# EAGLE schematic AeroQuad32 (EAGLE 5.11)
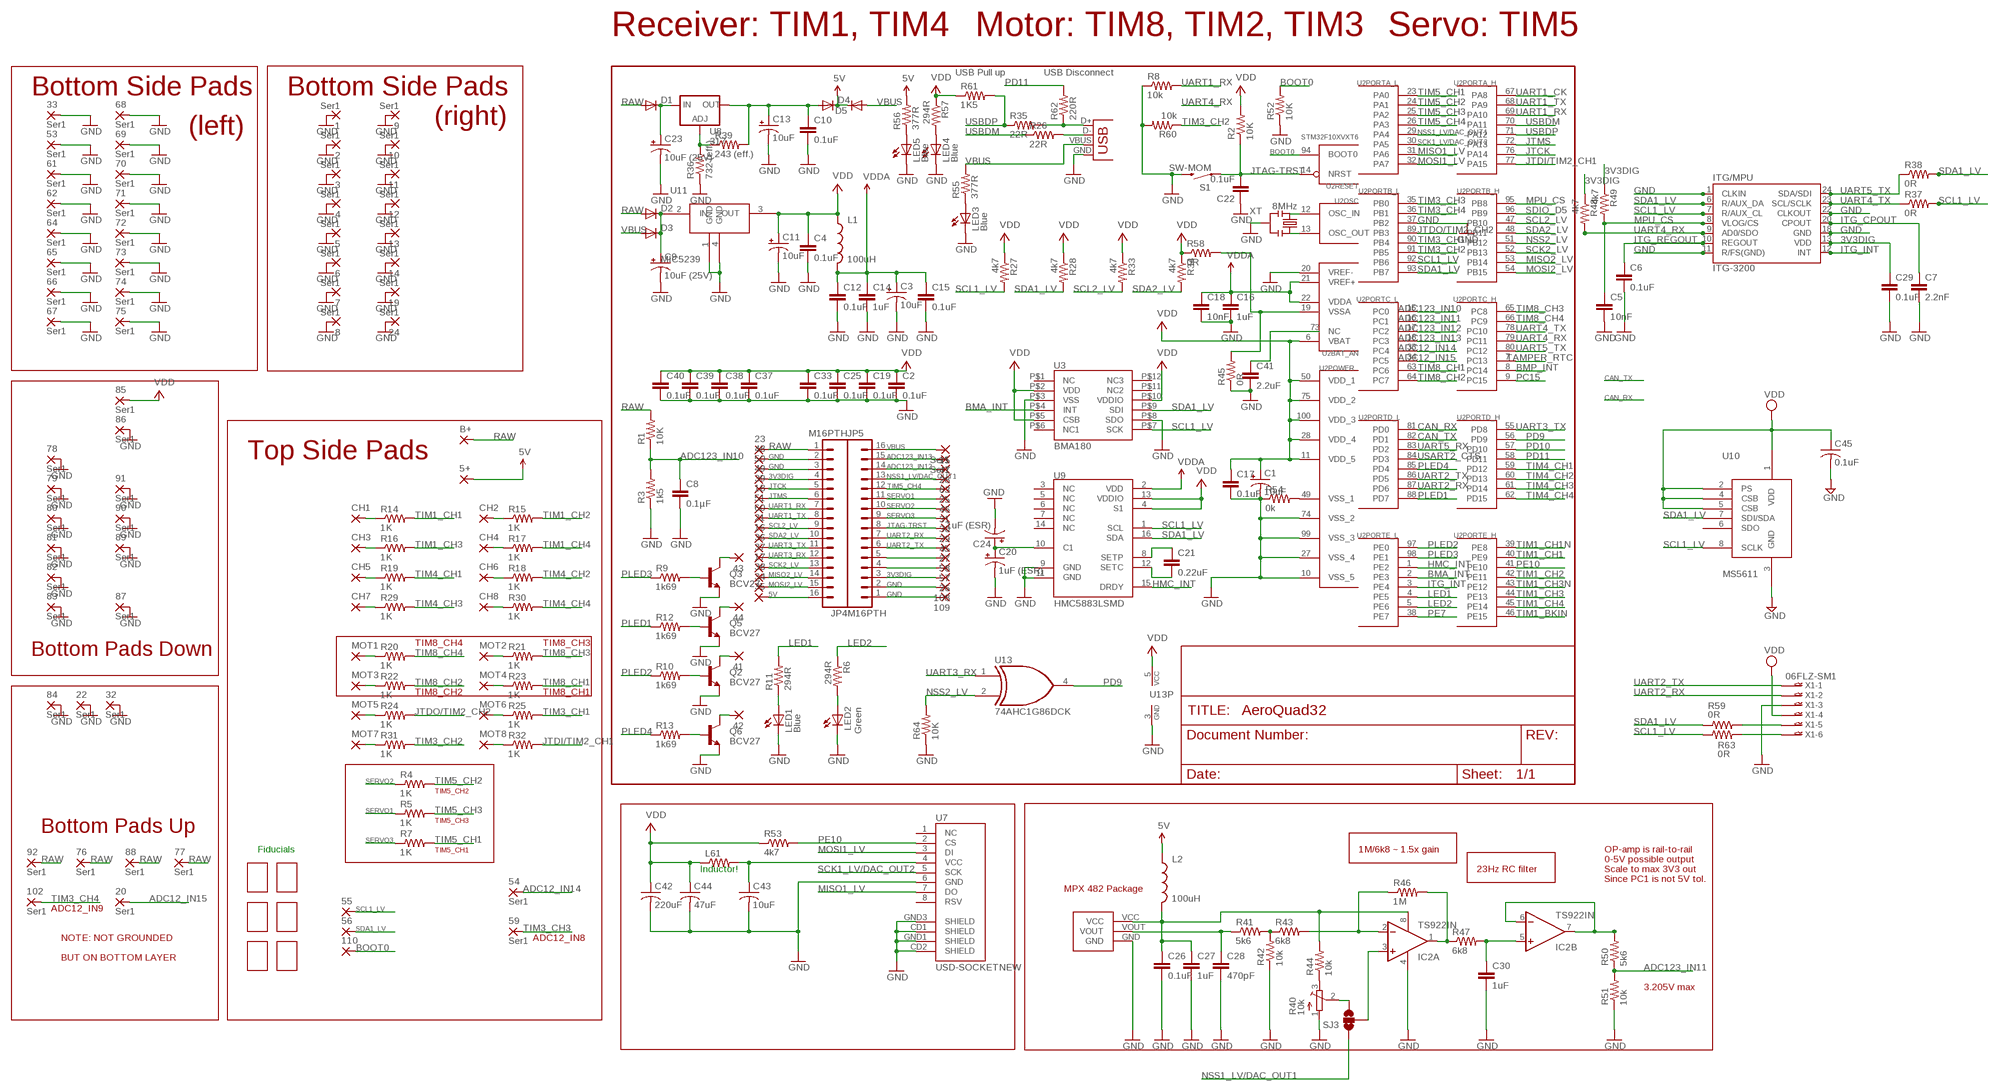
[diagram p0: schematic, sheet 1]

## Parts
1  Ser1  WIREPADSMD1,27-254  [SMD1,27-2,54]
2  Ser1  WIREPADSMD1,27-254  [SMD1,27-2,54]
3  Ser1  WIREPADSMD1,27-254  [SMD1,27-2,54]
4  Ser1  WIREPADSMD1,27-254  [SMD1,27-2,54]
5  Ser1  WIREPADSMD1,27-254  [SMD1,27-2,54]
5+  WIREPADSMD1,27-254  [SMD1,27-2,54]
6  Ser1  WIREPADSMD1,27-254  [SMD1,27-2,54]
7  Ser1  WIREPADSMD1,27-254  [SMD1,27-2,54]
8  Ser1  WIREPADSMD1,27-254  [SMD1,27-2,54]
9  Ser1  WIREPADSMD1,27-254  [SMD1,27-2,54]
10  Ser1  WIREPADSMD1,27-254  [SMD1,27-2,54]
11  Ser1  WIREPADSMD1,27-254  [SMD1,27-2,54]
12  Ser1  WIREPADSMD1,27-254  [SMD1,27-2,54]
13  Ser1  WIREPADSMD1,27-254  [SMD1,27-2,54]
14  Ser1  WIREPADSMD1,27-254  [SMD1,27-2,54]
15  WIREPADSMD1,27-254  [SMD1,27-2,54]
16  WIREPADSMD1,27-254  [SMD1,27-2,54]
17  WIREPADSMD1,27-254  [SMD1,27-2,54]
18  WIREPADSMD1,27-254  [SMD1,27-2,54]
19  Ser1  WIREPADSMD1,27-254  [SMD1,27-2,54]
20  Ser1  WIREPADSMD1,27-254  [SMD1,27-2,54]
21  WIREPADSMD1,27-254  [SMD1,27-2,54]
22  Ser1  WIREPADSMD1,27-254  [SMD1,27-2,54]
23  WIREPADSMD1,27-254  [SMD1,27-2,54]
24  Ser1  WIREPADSMD1,27-254  [SMD1,27-2,54]
25  WIREPADSMD1,27-254  [SMD1,27-2,54]
26  WIREPADSMD1,27-254  [SMD1,27-2,54]
27  WIREPADSMD1,27-254  [SMD1,27-2,54]
28  Ser1  WIREPADSMD1,27-254  [SMD1,27-2,54]
29  WIREPADSMD1,27-254  [SMD1,27-2,54]
30  WIREPADSMD1,27-254  [SMD1,27-2,54]
31  WIREPADSMD1,27-254  [SMD1,27-2,54]
32  Ser1  WIREPADSMD1,27-254  [SMD1,27-2,54]
33  Ser1  WIREPADSMD1,27-254  [SMD1,27-2,54]
34  WIREPADSMD1,27-254  [SMD1,27-2,54]
35  WIREPADSMD1,27-254  [SMD1,27-2,54]
36  WIREPADSMD1,27-254  [SMD1,27-2,54]
37  WIREPADSMD1,27-254  [SMD1,27-2,54]
38  WIREPADSMD1,27-254  [SMD1,27-2,54]
39  WIREPADSMD1,27-254  [SMD1,27-2,54]
41  WIREPADSMD1,27-254  [SMD1,27-2,54]
42  WIREPADSMD1,27-254  [SMD1,27-2,54]
43  WIREPADSMD1,27-254  [SMD1,27-2,54]
44  WIREPADSMD1,27-254  [SMD1,27-2,54]
45  WIREPADSMD1,27-254  [SMD1,27-2,54]
46  WIREPADSMD1,27-254  [SMD1,27-2,54]
47  WIREPADSMD1,27-254  [SMD1,27-2,54]
48  WIREPADSMD1,27-254  [SMD1,27-2,54]
49  WIREPADSMD1,27-254  [SMD1,27-2,54]
50  WIREPADSMD1,27-254  [SMD1,27-2,54]
51  WIREPADSMD1,27-254  [SMD1,27-2,54]
53  Ser1  WIREPADSMD1,27-254  [SMD1,27-2,54]
54  Ser1  WIREPADSMD1,27-254  [SMD1,27-2,54]
55  WIREPADSMD1,27-254  [SMD1,27-2,54]
56  WIREPADSMD1,27-254  [SMD1,27-2,54]
57  WIREPADSMD1,27-254  [SMD1,27-2,54]
58  WIREPADSMD1,27-254  [SMD1,27-2,54]
59  Ser1  WIREPADSMD1,27-254  [SMD1,27-2,54]
60  WIREPADSMD1,27-254  [SMD1,27-2,54]
61  Ser1  WIREPADSMD1,27-254  [SMD1,27-2,54]
62  Ser1  WIREPADSMD1,27-254  [SMD1,27-2,54]
63  Ser1  WIREPADSMD1,27-254  [SMD1,27-2,54]
64  Ser1  WIREPADSMD1,27-254  [SMD1,27-2,54]
65  Ser1  WIREPADSMD1,27-254  [SMD1,27-2,54]
66  Ser1  WIREPADSMD1,27-254  [SMD1,27-2,54]
67  Ser1  WIREPADSMD1,27-254  [SMD1,27-2,54]
68  Ser1  WIREPADSMD1,27-254  [SMD1,27-2,54]
69  Ser1  WIREPADSMD1,27-254  [SMD1,27-2,54]
70  Ser1  WIREPADSMD1,27-254  [SMD1,27-2,54]
71  Ser1  WIREPADSMD1,27-254  [SMD1,27-2,54]
72  Ser1  WIREPADSMD1,27-254  [SMD1,27-2,54]
73  Ser1  WIREPADSMD1,27-254  [SMD1,27-2,54]
74  Ser1  WIREPADSMD1,27-254  [SMD1,27-2,54]
75  Ser1  WIREPADSMD1,27-254  [SMD1,27-2,54]
76  Ser1  WIREPADSMD1,27-254  [SMD1,27-2,54]
77  Ser1  WIREPADSMD1,27-254  [SMD1,27-2,54]
78  Ser1  WIREPADSMD1,27-254  [SMD1,27-2,54]
79  Ser1  WIREPADSMD1,27-254  [SMD1,27-2,54]
80  Ser1  WIREPADSMD1,27-254  [SMD1,27-2,54]
81  Ser1  WIREPADSMD1,27-254  [SMD1,27-2,54]
82  Ser1  WIREPADSMD1,27-254  [SMD1,27-2,54]
83  Ser1  WIREPADSMD1,27-254  [SMD1,27-2,54]
84  Ser1  WIREPADSMD1,27-254  [SMD1,27-2,54]
85  Ser1  WIREPADSMD1,27-254  [SMD1,27-2,54]
86  Ser1  WIREPADSMD1,27-254  [SMD1,27-2,54]
87  Ser1  WIREPADSMD1,27-254  [SMD1,27-2,54]
88  Ser1  WIREPADSMD1,27-254  [SMD1,27-2,54]
89  Ser1  WIREPADSMD1,27-254  [SMD1,27-2,54]
90  Ser1  WIREPADSMD1,27-254  [SMD1,27-2,54]
91  Ser1  WIREPADSMD1,27-254  [SMD1,27-2,54]
92  Ser1  WIREPADSMD1,27-254  [SMD1,27-2,54]
102  Ser1  WIREPADSMD1,27-254  [SMD1,27-2,54]
108  WIREPADSMD1,27-254  [SMD1,27-2,54]
109  WIREPADSMD1,27-254  [SMD1,27-2,54]
110  WIREPADSMD1,27-254  [SMD1,27-2,54]
B+  WIREPADSMD1,27-254  [SMD1,27-2,54]
C1  10uF  CPOL-USSMCZ  [SMC_Z]
C2  0.1uF  CAP0402  [C0402]
C3  10uF  CAP_POL1206  [EIA3216]
C4  0.1uF  CAP0402  [C0402]
C5  10nF  CAP0402  [C0402]
C6  0.1uF  CAP0402  [C0402]
C7  2.2nF  CAP0402  [C0402]
C8  0.1µF  CAP0402  [C0402]
C9  10uF (25V)  CAP_POL1206  [EIA3216]
C10  0.1uF  CAP0402  [C0402]
C11  10uF  CAP_POL1206  [EIA3216]
C12  0.1uF  CAP0402  [C0402]
C13  10uF  CAP_POL1206  [EIA3216]
C14  1uF  CAP0402  [C0402]
C15  0.1uF  CAP0402  [C0402]
C16  1uF  CAP0402  [C0402]
C17  0.1uF  CAP0402  [C0402]
C18  10nF  CAP0402  [C0402]
C19  0.1uF  CAP0402  [C0402]
C20  1uF (ESR)  CPOL-USSMCZ  [SMC_Z]
C21  0.22uF  CAP0402  [C0402]
C22  0.1uF  CAP0402  [C0402]
C23  10uF (25V)  CAP_POL1206  [EIA3216]
C24  1uF (ESR)  CPOL-USSMCZ  [SMC_Z]
C25  0.1uF  CAP0402  [C0402]
C26  0.1uF  CAP0402  [C0402]
C27  1uF  CAP0402  [C0402]
C28  470pF  CAP0402  [C0402]
C29  0.1uF  CAP0402  [C0402]
C30  1uF  CAP0402  [C0402]
C33  0.1uF  CAP0402  [C0402]
C37  0.1uF  CAP0402  [C0402]
C38  0.1uF  CAP0402  [C0402]
C39  0.1uF  CAP0402  [C0402]
C40  0.1uF  CAP0402  [C0402]
C41  2.2uF  CAP0402  [C0402]
C42  220uF  C-USC0805  [C0805]
C43  10uF  C-USC0805  [C0805]
C44  47uF  C-USC1206  [C1206]
C45  0.1uF  C-USC0402  [C0402]
CH1  WIREPADSMD1,27-254  [SMD1,27-2,54]
CH2  WIREPADSMD1,27-254  [SMD1,27-2,54]
CH3  WIREPADSMD1,27-254  [SMD1,27-2,54]
CH4  WIREPADSMD1,27-254  [SMD1,27-2,54]
CH5  WIREPADSMD1,27-254  [SMD1,27-2,54]
CH6  WIREPADSMD1,27-254  [SMD1,27-2,54]
CH7  WIREPADSMD1,27-254  [SMD1,27-2,54]
CH8  WIREPADSMD1,27-254  [SMD1,27-2,54]
D1  DIODESOD  [SOD-323]
D2  DIODESOD  [SOD-323]
D3  DIODESOD  [SOD-323]
D4  DIODESOD  [SOD-323]
D5  DIODESOD  [SOD-323]
IC2  TS922IN  LM358D  [SO08]
JP4  M16PTH  [1X16]
JP5  M16PTH  [1X16]
L1  100uH  INDUCTOR0805  [0805]
L2  100uH  INDUCTOR0805  [0805]
L61  R-US_R0805  [R0805]
LED1  Blue  LED0603  [LED-0603]
LED2  Green  LED0603  [LED-0603]
LED3  Blue  LED0603  [LED-0603]
LED4  Blue  LED0603  [LED-0603]
LED5  Blue  LED0603  [LED-0603]
MOT1  WIREPADSMD1,27-254  [SMD1,27-2,54]
MOT2  WIREPADSMD1,27-254  [SMD1,27-2,54]
MOT3  WIREPADSMD1,27-254  [SMD1,27-2,54]
MOT4  WIREPADSMD1,27-254  [SMD1,27-2,54]
MOT5  WIREPADSMD1,27-254  [SMD1,27-2,54]
MOT6  WIREPADSMD1,27-254  [SMD1,27-2,54]
MOT7  WIREPADSMD1,27-254  [SMD1,27-2,54]
MOT8  WIREPADSMD1,27-254  [SMD1,27-2,54]
Q2  BCV27  TRANSISTOR_NPNSOT23-3  [SOT23-3]
Q3  BCV27  TRANSISTOR_NPNSOT23-3  [SOT23-3]
Q5  BCV27  TRANSISTOR_NPNSOT23-3  [SOT23-3]
Q6  BCV27  TRANSISTOR_NPNSOT23-3  [SOT23-3]
R1  10K  RESISTOR0402  [C0402]
R2  10K  RESISTOR0402  [C0402]
R3  1k5  RESISTOR0402  [C0402]
R4  1K  RESISTOR0402  [C0402]
R5  1K  RESISTOR0402  [C0402]
R6  294R  RESISTOR0402  [C0402]
R7  1K  RESISTOR0402  [C0402]
R8  10k  R-US_R0402  [R0402]
R9  1k69  RESISTOR0402  [C0402]
R10  1k69  RESISTOR0402  [C0402]
R11  294R  RESISTOR0402  [C0402]
R12  1k69  RESISTOR0402  [C0402]
R13  1k69  RESISTOR0402  [C0402]
R14  1K  RESISTOR0402  [C0402]
R15  1K  RESISTOR0402  [C0402]
R16  1K  RESISTOR0402  [C0402]
R17  1K  RESISTOR0402  [C0402]
R18  1K  RESISTOR0402  [C0402]
R19  1K  RESISTOR0402  [C0402]
R20  1K  RESISTOR0402  [C0402]
R21  1K  RESISTOR0402  [C0402]
R22  1K  RESISTOR0402  [C0402]
R23  1K  RESISTOR0402  [C0402]
R24  1K  RESISTOR0402  [C0402]
R25  1K  RESISTOR0402  [C0402]
R26  22R  RESISTOR0402  [C0402]
R27  4k7  RESISTOR0402  [C0402]
R28  4k7  RESISTOR0402  [C0402]
R29  1K  RESISTOR0402  [C0402]
R30  1K  RESISTOR0402  [C0402]
R31  1K  RESISTOR0402  [C0402]
R32  1K  RESISTOR0402  [C0402]
R33  4k7  RESISTOR0402  [C0402]
R34  4k7  RESISTOR0402  [C0402]
R35  22R  RESISTOR0402  [C0402]
R36  732 (eff.)  RESISTOR0603  [0603]
R37  0R  R-US_R0402  [R0402]
R38  0R  R-US_R0402  [R0402]
R39  243 (eff.)  RESISTOR0603  [0603]
R40  10k  TRIM_EU-3223J  [3223J]
R41  5k6  RESISTOR0402  [C0402]
R42  10k  RESISTOR0402  [C0402]
R43  6k8  RESISTOR0402  [C0402]
R44  10k  RESISTOR0402  [C0402]
R45  0R  R-US_R0402  [R0402]
R46  1M  RESISTOR0402  [C0402]
R47  6k8  RESISTOR0402  [C0402]
R48  4k7  RESISTOR0402  [C0402]
R49  4k7  RESISTOR0402  [C0402]
R50  5k6  RESISTOR0402  [C0402]
R51  10k  RESISTOR0402  [C0402]
R52  10K  RESISTOR0402  [C0402]
R53  4k7  RESISTOR0402  [C0402]
R54  0k  RESISTOR0402  [C0402]
R55  377R  RESISTOR0402  [C0402]
R56  377R  RESISTOR0402  [C0402]
R57  294R  RESISTOR0402  [C0402]
R58  0R  R-US_R0402  [R0402]
R59  0R  RESISTOR0402  [C0402]
R60  10k  R-US_R0402  [R0402]
R61  1K5  R-US_R0402  [R0402]
R62  220R  RESISTOR0402  [C0402]
R63  0R  RESISTOR0402  [C0402]
R64  10K  RESISTOR0402  [C0402]
S1  SW-MOM  SWITCH-MOMENTARY-2SMD  [TACTILE_SWITCH_SMD]
SJ3  SOLDERJUMPER_2WAYS  [SJ_3]
U1  ITG-3200  [QFN-24]
U2  STM32F10XVXT6  [TQFP100]
U3  BMA180  [LGA12]
U7  USD-SOCKETNEW  [MICRO-SD-SOCKET-PP]
U8  317  V_REG_317SMD  [SOT223]
U9  HMC5883LSMD  [16LPCC]
U10  MS5611  [LGA08A]
U11  MIC5239  [TO-223]
U12  MPX_SMD  [MPX_SMD]
U13  74AHC1G86DCK  [SC70-5]
U$7  PAD.03  [PAD.03X.03]
U$9  PAD.03  [PAD.03X.03]
U$10  PAD.03  [PAD.03X.03]
U$11  PAD.03  [PAD.03X.03]
U$12  PAD.03  [PAD.03X.03]
U$13  PAD.03  [PAD.03X.03]
X1  06FLZ-SM1  [6SMT-R]
X2  USBOLD  [USB-MINIB-OLD]
XT  8MHz  RESONATORSMD  [RESONATOR-SMD]

## Nets
3IN [vcc]: C9.A(+) D2.1(C) D3.1(C) U11.2(IN)
3V3AN: C3.A(+) C12.1 C14.1 C15.1 C16.1 C18.1 L1.2 U2.21(BAT_AN:VREF+) U2.22(BAT_AN:VDDA) U9.2(VDD) ; supply symbol labelled VDDA
3V3DIG: 26.1(P) 49.1(P) 85.1(P) C1.+ C2.1 C4.1 C11.A(+) C17.1 C19.1 C25.1 C29.1 C33.1 C37.1 C38.1 C39.1 C40.1 C42.1 C44.1 C45.1 JP4.4 JP5.3 L1.1 L61.1 R2.2 R27.1 R28.1 R33.1 R34.1 R48.1 R49.1 R53.1 R57.1 R58.1 R61.1 U1.13(VDD) U2.6(BAT_AN:VBAT) U2.11(POWER:VDD_5) U2.28(POWER:VDD_4) U2.50(POWER:VDD_1) U2.75(POWER:VDD_2) U2.100(POWER:VDD_3) U3.P$2(VDD) U3.P$5(CSB) U3.P$10(VDDIO) U9.4(S1) U9.13(VDDIO) U10.1(VDD) U10.2(PS) U10.4(CSB) U10.5(CSB) U11.3(OUT) U13.5(VCC) X1.4 ; supply symbol labelled VDD
5IN [vcc]: C23.A(+) D1.1(C) U8.3(IN)
5V: 5+.1(P) 35.1(P) D4.1(C) D5.1(C) JP4.16 L2.1 R56.2
ADC12_IN14: 54.1(P) U2.33(PORTC_L:PC4)
ADC12_IN15: 20.1(P) U2.34(PORTC_L:PC5)
ADC123_IN10: C8.1 R1.1 R3.2 U2.15(PORTC_L:PC0)
ADC123_IN11: R50.1 R51.2 U2.16(PORTC_L:PC1)
ADC123_IN12: 28.1(P) JP5.14 U2.17(PORTC_L:PC2)
ADC123_IN13: 47.1(P) JP5.15 U2.18(PORTC_L:PC3)
BMA_INT: U2.2(PORTE_L:PE3) U3.P$4(INT)
BMP_INT: U2.8(PORTC_H:PC14)
BOOT0: 110.1(P) R52.2 U2.94(RESET:BOOT0)
CAN_RX: U2.81(PORTD_L:PD0)
CAN_TX: U2.82(PORTD_L:PD1)
GND [vcc]: 1.1(P) 2.1(P) 3.1(P) 4.1(P) 5.1(P) 6.1(P) 7.1(P) 8.1(P) 9.1(P) 10.1(P) 11.1(P) 12.1(P) 13.1(P) 14.1(P) 19.1(P) 22.1(P) 24.1(P) 32.1(P) 33.1(P) 48.1(P) 50.1(P) 53.1(P) 61.1(P) 62.1(P) 64.1(P) 65.1(P) 66.1(P) 67.1(P) 68.1(P) 69.1(P) 70.1(P) 71.1(P) 72.1(P) 73.1(P) 74.1(P) 75.1(P) 78.1(P) 79.1(P) 80.1(P) 81.1(P) 82.1(P) 83.1(P) 84.1(P) 86.1(P) 87.1(P) 89.1(P) 90.1(P) 91.1(P) 108.1(P) 109.1(P) C1.- C2.2 C3.C(-) C4.2 C5.2 C6.2 C7.2 C8.2 C9.C(-) C10.2 C11.C(-) C12.2 C13.C(-) C14.2 C15.2 C16.2 C17.2 C18.2 C19.2 C20.- C22.1 C23.C(-) C24.- C25.2 C26.2 C27.2 C28.2 C29.2 C30.2 C33.2 C37.2 C38.2 C39.2 C40.2 C41.2 C42.2 C43.2 C44.2 C45.2 IC2.4(P:V-) JP4.2 JP4.3 JP5.1 JP5.2 LED1.C LED2.C LED3.C LED4.C LED5.C Q2.2(E) Q3.2(E) Q5.2(E) Q6.2(E) R3.1 R8.1 R36.1 R40.1(A) R42.1 R45.1 R51.1 R52.1 R54.1 R60.2 R64.1 S1.3 U1.1(CLKIN) U1.11(R/FS(GND)) U1.18(GND) U1.22(CLKOUT) U2.10(POWER:VSS_5) U2.20(BAT_AN:VREF-) U2.27(POWER:VSS_4) U2.37(PORTB_L:PB2) U2.74(POWER:VSS_2) U2.99(POWER:VSS_3) U3.P$3(VSS) U3.P$8(SDO) U7.6(GND) U7.CD1(SHIELD) U7.CD2(SHIELD) U7.GND1(SHIELD) U7.GND3(SHIELD) U9.9(GND) U9.11(GND) U10.3(GND) U11.1(GND) U11.4(GND) U12.GND U13.3(GND) X1.3 X2.GND XT.2
HMC_INT: U2.1(PORTE_L:PE2) U9.15(DRDY)
ITG_CPOUT: C7.1 U1.20(CPOUT)
ITG_INT: U1.12(INT) U2.3(PORTE_L:PE4)
ITG_REGOUT: C6.1 U1.10(REGOUT)
JTAG-TRST: 29.1(P) C22.2 JP5.8 R2.1 S1.1 U2.14(RESET:NRST)
JTCK: 39.1(P) JP4.5 U2.76(PORTA_H:PA14)
JTDI/TIM2_CH1: R32.2 U2.77(PORTA_H:PA15)
JTDO/TIM2_CH2: R24.2 U2.89(PORTB_L:PB3)
JTMS: 18.1(P) JP4.6 U2.72(PORTA_H:PA13)
LED1: R11.2 U2.4(PORTE_L:PE5)
LED2: R6.1 U2.5(PORTE_L:PE6)
MISO1_LV: U2.31(PORTA_L:PA6) U7.7(DO)
MISO2_LV: 38.1(P) JP4.14 U2.53(PORTB_H:PB14)
MOSI1_LV: U2.32(PORTA_L:PA7) U7.3(DI)
MOSI2_LV: 34.1(P) JP4.15 U2.54(PORTB_H:PB15)
MPU_CS: C5.1 R49.2 U1.8(VLOG/CS) U2.95(PORTB_H:PB8)
N$1: U2.12(OSC:OSC_IN) XT.3
N$2: U2.13(OSC:OSC_OUT) XT.1
N$3: CH4.1(P) R17.1
N$4: MOT1.1(P) R20.1
N$5: R40.2(S) SJ3.3
N$6: 58.1(P) JP5.5
N$7: LED2.A R6.2
N$8: 57.1(P) JP5.4
N$9: Q3.1(B) R9.2
N$10: R54.2 U2.49(POWER:VSS_1)
N$11: Q2.1(B) R10.2
N$12: Q5.1(B) R12.2
N$13: MOT2.1(P) R21.1
N$14: MOT3.1(P) R22.1
N$15: LED1.A R11.1
N$16: R36.2 R39.1 U8.1(ADJ)
N$17: CH1.1(P) R14.1
N$18: CH2.1(P) R15.1
N$19: CH3.1(P) R16.1
N$20: MOT4.1(P) R23.1
N$21: CH5.1(P) R19.1
N$22: CH6.1(P) R18.1
N$23: Q6.1(B) R13.2
N$24: 44.1(P) Q5.3(C)
N$25: 41.1(P) Q2.3(C)
N$26: 43.1(P) Q3.3(C)
N$27: 42.1(P) Q6.3(C)
N$28: C41.1 U2.73(BAT_AN:NC)
N$29: LED3.A R55.1
N$30: CH7.1(P) R29.1
N$31: MOT5.1(P) R24.1
N$32: MOT6.1(P) R25.1
N$33: IC2.3(A:+IN) SJ3.2
N$34: LED4.A R57.2
N$35: LED5.A R56.1
N$36: R45.2 R58.2 U2.19(BAT_AN:VSSA)
N$37: CH8.1(P) R30.1
N$38: MOT7.1(P) R31.1
N$39: MOT8.1(P) R32.1
N$40: C43.1 L61.2 U7.4(VCC)
N$41: C21.1 U9.8(SETP)
N$42: C21.2 U9.12(SETC)
N$43: C26.1 C27.1 IC2.8(P:V+) L2.2 R44.2 U12.VCC
N$44: R59.2 X1.5
N$45: C10.1 C13.A(+) D4.2(A) R39.2 U8.2(OUT)
N$46: R63.2 X1.6
N$67: C20.+ C24.+ U9.10(C1)
N$72: R35.2 R62.1 X2.D+
N$74: R26.2 X2.D-
N$76: C28.1 R41.1 U12.VOUT
N$77: R41.2 R42.2 R43.1
N$79: IC2.2(A:-IN) R43.2 R46.1
N$81: R40.3(E) R44.1
N$82: IC2.1(A:OUT) R46.2 R47.1
N$98: C30.1 IC2.5(B:+IN) R47.2
N$101: IC2.6(B:-IN) IC2.7(B:OUT) R50.2
NSS1_LV/DAC_OUT1: 63.1(P) JP5.13 SJ3.1 U2.29(PORTA_L:PA4)
NSS2_LV: R64.2 U2.51(PORTB_H:PB12) U13.2(I1)
PC15: U2.9(PORTC_H:PC15)
PD9: U2.56(PORTD_H:PD9) U13.4(O)
PD10: U2.57(PORTD_H:PD10)
PD11: R62.2 U2.58(PORTD_H:PD11)
PE7: U2.38(PORTE_L:PE7)
PE10: R53.2 U2.41(PORTE_H:PE10) U7.2(CS)
PLED1: R12.1 U2.88(PORTD_L:PD7)
PLED2: R10.1 U2.97(PORTE_L:PE0)
PLED3: R9.1 U2.98(PORTE_L:PE1)
PLED4: R13.1 U2.85(PORTD_L:PD4)
RAW [vcc]: 23.1(P) 76.1(P) 77.1(P) 88.1(P) 92.1(P) B+.1(P) D1.2(A) D2.2(A) JP4.1 R1.2
SCK1_LV/DAC_OUT2: U2.30(PORTA_L:PA5) U7.5(SCK)
SCK2_LV: 17.1(P) JP4.13 U2.52(PORTB_H:PB13)
SCL1_LV: 55.1(P) R27.2 R37.2 R63.1 U1.7(R/AUX_CL) U2.92(PORTB_L:PB6) U3.P$7(SCK) U9.1(SCL) U10.8(SCLK)
SCL2_LV: 21.1(P) JP4.9 R33.2 U2.47(PORTB_H:PB10)
SDA1_LV: 56.1(P) R28.2 R38.2 R59.1 U1.6(R/AUX_DA) U2.93(PORTB_L:PB7) U3.P$9(SDI) U9.16(SDA) U10.7(SDI/SDA)
SDA2_LV: 16.1(P) JP4.10 R34.2 U2.48(PORTB_H:PB11)
SDIO_D5: U2.96(PORTB_H:PB9)
SERVO1: 46.1(P) JP5.11 R5.1
SERVO2: 31.1(P) JP5.10 R4.1
SERVO3: 30.1(P) JP5.9 R7.1
TAMPER_RTC: U2.7(PORTC_H:PC13)
TIM1_BKIN: U2.46(PORTE_H:PE15)
TIM1_CH1: R14.2 U2.40(PORTE_H:PE9)
TIM1_CH1N: U2.39(PORTE_H:PE8)
TIM1_CH2: R15.2 U2.42(PORTE_H:PE11)
TIM1_CH3: R16.2 U2.44(PORTE_H:PE13)
TIM1_CH3N: U2.43(PORTE_H:PE12)
TIM1_CH4: R17.2 U2.45(PORTE_H:PE14)
TIM3_CH1: R25.2 U2.90(PORTB_L:PB4)
TIM3_CH2: R31.2 R60.1 U2.91(PORTB_L:PB5)
TIM3_CH3: 59.1(P) U2.35(PORTB_L:PB0)
TIM3_CH4: 102.1(P) U2.36(PORTB_L:PB1)
TIM4_CH1: R19.2 U2.59(PORTD_H:PD12)
TIM4_CH2: R18.2 U2.60(PORTD_H:PD13)
TIM4_CH3: R29.2 U2.61(PORTD_H:PD14)
TIM4_CH4: R30.2 U2.62(PORTD_H:PD15)
TIM5_CH1: R7.2 U2.23(PORTA_L:PA0)
TIM5_CH2: R4.2 U2.24(PORTA_L:PA1)
TIM5_CH3: R5.2 U2.25(PORTA_L:PA2)
TIM5_CH4: 25.1(P) JP5.12 U2.26(PORTA_L:PA3)
TIM8_CH1: R23.2 U2.63(PORTC_L:PC6)
TIM8_CH2: R22.2 U2.64(PORTC_L:PC7)
TIM8_CH3: R21.2 U2.65(PORTC_H:PC8)
TIM8_CH4: R20.2 U2.66(PORTC_H:PC9)
UART1_CK: U2.67(PORTA_H:PA8)
UART1_RX: 51.1(P) JP4.7 R8.2 U2.69(PORTA_H:PA10)
UART1_TX: 60.1(P) JP4.8 U2.68(PORTA_H:PA9)
UART2_RX: 45.1(P) JP5.7 U2.87(PORTD_L:PD6) X1.2
UART2_TX: 27.1(P) JP5.6 U2.86(PORTD_L:PD5) X1.1
UART3_RX: 37.1(P) JP4.12 U13.1(I0)
UART3_TX: 36.1(P) JP4.11 U2.55(PORTD_H:PD8)
UART4_RX: R48.2 U1.9(AD0/SDO) U2.79(PORTC_H:PC11)
UART4_TX: R37.1 U1.23(SCL/SCLK) U2.78(PORTC_H:PC10)
UART5_RX: U2.83(PORTD_L:PD2)
UART5_TX: R38.1 U1.24(SDA/SDI) U2.80(PORTC_H:PC12)
USART2_CTS: U2.84(PORTD_L:PD3)
USBDM: R26.1 U2.70(PORTA_H:PA11)
USBDP: R35.1 R61.2 U2.71(PORTA_H:PA12)
VBUS: 15.1(P) D3.2(A) D5.2(A) JP5.16 R55.2 X2.VBUS
Unconnected: U3.P$1(NC) U3.P$6(NC1) U3.P$11(NC2) U3.P$12(NC3) U7.1(NC) U7.8(RSV) U9.3(NC) U9.5(NC) U9.6(NC) U9.7(NC) U9.14(NC) U10.6(SDO)

## Notes on the sheet
- Receiver: TIM1, TIM4 | Motor: TIM8, TIM2, TIM3 | Servo: TIM5
- USB Pull up | USB Disconnect
- Bottom Side Pads | Bottom Side Pads
- (right)
- (left)
- Top Side Pads
- TIM8_CH4 | TIM8_CH3
- Bottom Pads Down
- TIM8_CH2 | TIM8_CH1
- TIM5_CH2
- TIM5_CH3
- Bottom Pads Up
- Fiducials | TIM5_CH1 | 1M/6k8 ~ 1.5x gain | OP-amp is rail-to-rail
- 0-5V possible output
- Inductor! | 23Hz RC filter | Scale to max 3V3 out
- Since PC1 is not 5V tol.
- MPX 482 Package
- ADC12_IN9
- NOTE: NOT GROUNDED | ADC12_IN8
- BUT ON BOTTOM LAYER
- 3.205V max

## Library data of the parts
1-5 5+ 6-39 41-51 53-92 102 108-110 B+ CH1-CH8 MOT1-MOT8 = wirepad:WIREPAD: Wire PAD connect wire on PCB
C1 C20 C24 = rcl:CPOL-US: POLARIZED CAPACITOR, American symbol
C2 C4-C8 C10 C12 C14-C19 C21 C22 C25-C30 C33 C37-C41 = SparkFun:CAP: Capacitor Standard 0603 ceramic capacitor, and 0.1" leaded capacitor.
C3 C9 C11 C13 C23 = SparkFun:CAP_POL: Capacitor Polarized These are standard SMD and PTH capacitors. Normally 10uF, 47uF, and 100uF in electrolytic and tantalum varieties. Always verify the external diameter of the through hole cap, it varies with capacity, voltage, and manufacturer. The EIA devices should be standard.
C42-C45 = rcl:C-US: CAPACITOR, American symbol
D1-D5 = SparkFun:DIODE: Diode These are standard reverse protection diodes and small signal diodes. SMA package can handle up to about 1A. SOD-323 can handle about 200mA. What the SOD-323 package when ordering, there are some mfgs out there that are 5-pin packages.
IC2 = linear:LM358: OP AMP also LM158; LM258; LM2904 Source: http://cache.national.com/ds/LM/LM158.pdf
JP4 JP5 = SparkFun:M16
L1 L2 = SparkFun:INDUCTOR: Inductors Basic Inductor/Choke - 0603 and 1206. Footprints are not proven and vary greatly between part numbers.
L61 R8 R60 R61 = rcl:R-US_: RESISTOR, American symbol
LED1-LED5 = SparkFun:LED: LEDs Standard schematic elements and footprints for 5mm, 3mm, 1206, and 0603 sized LEDs. 5mm - Spark Fun Electronics SKU : COM-00529 (and others)
Q2 Q3 Q5 Q6 = SparkFun:TRANSISTOR_NPN: Transistor NPN BJT configuration in SOT23 package. MMBT2222 is the common NPN we use. Double check BCE configuration again layout.
R1-R7 R9-R36 R39 R41-R44 R46-R57 R59 R62-R64 = SparkFun:RESISTOR: Resistor Basic schematic elements and footprints for 0603, 1206, and PTH 1/10th watt (small) resistors.
R37 R38 R45 R58 = resistor:R-US_: RESISTOR, American symbol
R40 = pot:TRIM_EU-: POTENTIOMETER
S1 = SparkFun:SWITCH-MOMENTARY-2
SJ3 = SparkFun:SOLDERJUMPER_2WAY: Solder Jumper 2 way solder jumper
U1 = SparkFunMod:ITG-3200: ITG-3200 3-axis gyro, digital output, qfn24 package
U2 = stm32:STM32F10XVXT6: STM32F101/103 100 pin LQFP
U3 = SparkFun:BMA180
U7 = SparkFun:USD-SOCKET: microSD Socket Push-push type uSD socket. Schematic element and footprint production proven. Spark Fun Electronics SKU : PRT-00127. tDoc lines correctly indicate media card edge positions when inserting (unlocked, locked, depressed).
U8 = SparkFun:V_REG_317: Voltage Regulator Standard LM317 adjustable voltage regulator. AOI (Adjust Output Input). Google 'LM317 Calculator' for easy to use app to get the two resistor values needed. 240/720 for 5V output. 240/390 for 3.3V output. Spark Fun Electronics SKU : COM-00527
U9 = SparkFun:HMC5883L: 3 Axis Digital Compass IC
U10 = DSP-TI:MS5611: Pressure sensor 10cm
U11 = DSP-TI:MIC5239: LOD Volt Reg
U12 = MPX_SMD:MPX_SMD
U13 = 74xx-little-us:74*1G86: 2-input EXCLUSIV-OR gate
U$7 U$9-U$13 = SparkFun:PAD
X1 = con-jst:06FLZ-SM1: CONNECTOR
X2 = SparkFun:USB: USB Connectors USB-B-PTH is fully proven SKU : PRT-00139 USB-miniB is fully proven SKU : PRT-00587 USB-A-PCB is untested. USB-A-H is throughly reviewed, but untested. Spark Fun Electronics SKU : PRT-00437 USB-B-SMT is throughly reviewed, but untested. Needs silkscreen touching up. USB-A-S has not been used/tested USB-MB-H has not been used/tested
XT = SparkFun:RESONATOR: Resonator Small SMD resonator. This is the itty bitty 10/20MHz resonators with built in caps. CSTCE10M0G55 and CSTCE20M0V53. Footprint has been reviewed closely but hasn't been tested yet.

## Net classes
0 default: width 0.203 mm
1 vcc: width 0.254 mm